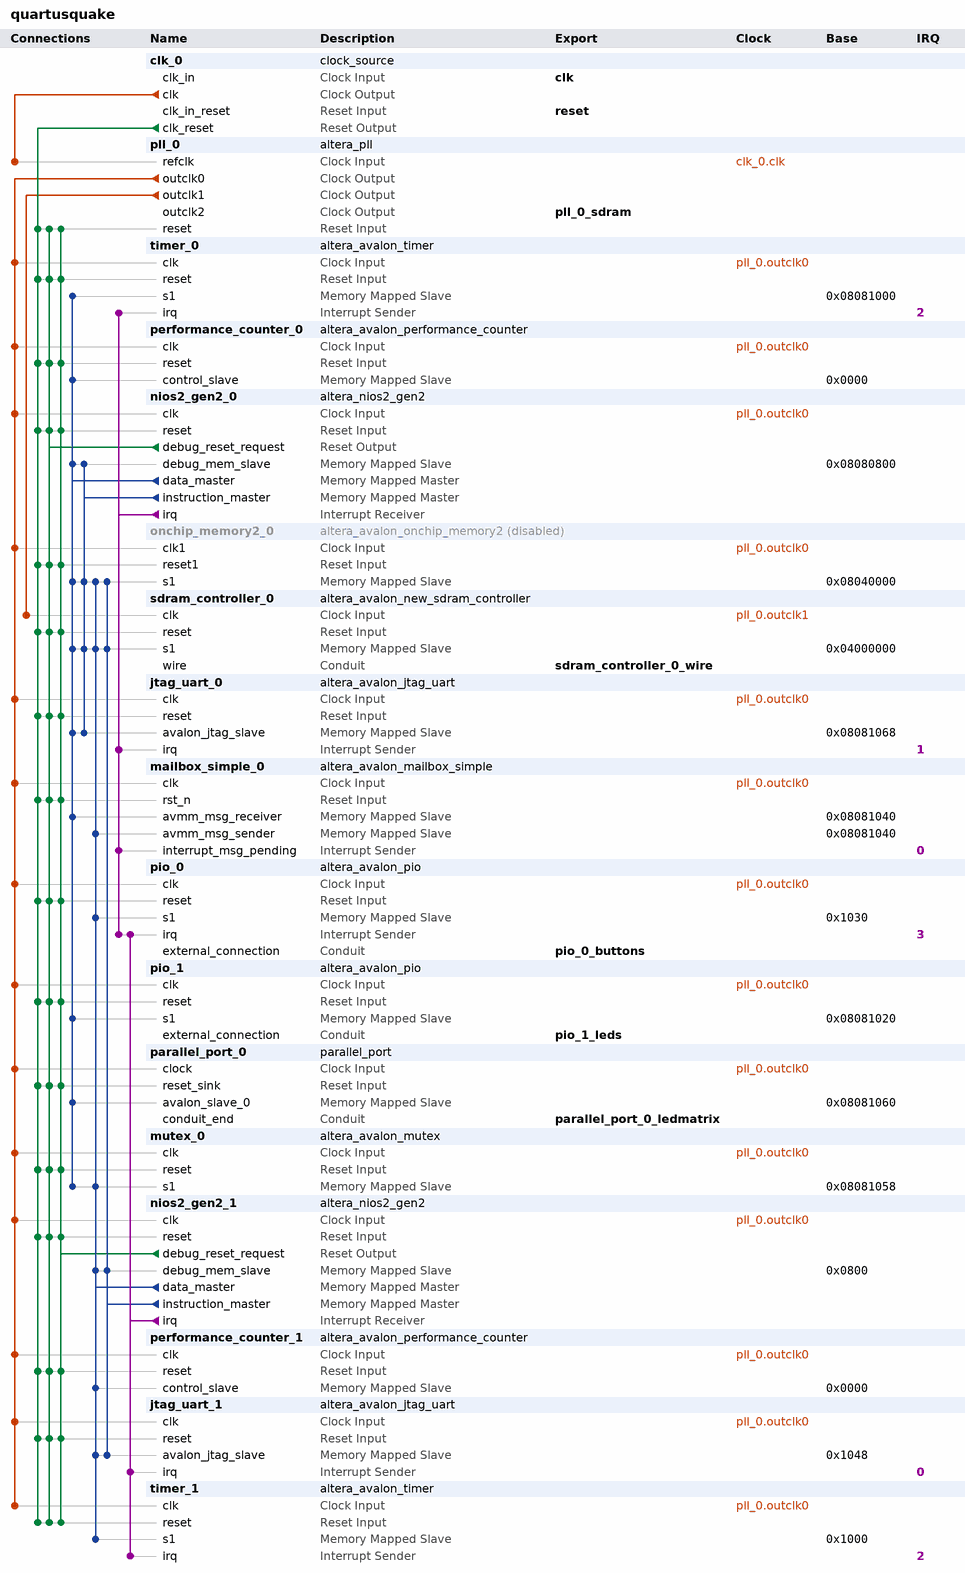
[diagram p0: system contents]
# Platform Designer (Qsys) system quartusquake, Cyclone V 5CSEMA5F31C6
# Parameters at their usual value, and those the tool derives, are not listed.
package require -exact qsys 18.1
create_system quartusquake
set_project_property DEVICE_FAMILY {Cyclone V}
set_project_property DEVICE 5CSEMA5F31C6

add_instance clk_0 clock_source 18.1
set_instance_parameter_value clk_0 clockFrequency 50000000
set_instance_parameter_value clk_0 resetSynchronousEdges DEASSERT

add_instance pll_0 altera_pll 18.1
set_instance_parameter_value pll_0 gui_device_speed_grade 1
set_instance_parameter_value pll_0 gui_number_of_clocks 3
set_instance_parameter_value pll_0 gui_operation_mode normal
set_instance_parameter_value pll_0 gui_output_clock_frequency0 50.0
set_instance_parameter_value pll_0 gui_output_clock_frequency1 100.0
set_instance_parameter_value pll_0 gui_output_clock_frequency2 100.0
set_instance_parameter_value pll_0 gui_phase_shift2 -3758
set_instance_parameter_value pll_0 gui_pll_mode {Integer-N PLL}
set_instance_parameter_value pll_0 gui_reference_clock_frequency 50.0
set_instance_parameter_value pll_0 gui_use_locked false

add_instance timer_0 altera_avalon_timer 18.1
set_instance_parameter_value timer_0 period 50
set_instance_parameter_value timer_0 periodUnits MSEC

add_instance performance_counter_0 altera_avalon_performance_counter 18.1
set_instance_parameter_value performance_counter_0 numberOfSections 3

add_instance nios2_gen2_0 altera_nios2_gen2 18.1
set_instance_parameter_value nios2_gen2_0 dcache_size 0
set_instance_parameter_value nios2_gen2_0 exceptionSlave sdram_controller_0.s1
set_instance_parameter_value nios2_gen2_0 icache_size 0
set_instance_parameter_value nios2_gen2_0 impl Fast
set_instance_parameter_value nios2_gen2_0 resetSlave sdram_controller_0.s1

add_instance onchip_memory2_0 altera_avalon_onchip_memory2 18.1
set_instance_property onchip_memory2_0 ENABLED false
set_instance_parameter_value onchip_memory2_0 dataWidth 32
set_instance_parameter_value onchip_memory2_0 dualPort false
set_instance_parameter_value onchip_memory2_0 initMemContent true
set_instance_parameter_value onchip_memory2_0 initializationFileName onchip_mem.hex
set_instance_parameter_value onchip_memory2_0 memorySize 262144

add_instance sdram_controller_0 altera_avalon_new_sdram_controller 18.1
set_instance_parameter_value sdram_controller_0 TAC 5.4
set_instance_parameter_value sdram_controller_0 TRCD 15.0
set_instance_parameter_value sdram_controller_0 TRP 15.0
set_instance_parameter_value sdram_controller_0 casLatency 3
set_instance_parameter_value sdram_controller_0 columnWidth 10
set_instance_parameter_value sdram_controller_0 dataWidth 16
set_instance_parameter_value sdram_controller_0 generateSimulationModel false
set_instance_parameter_value sdram_controller_0 model single_Micron_MT48LC4M32B2_7_chip
set_instance_parameter_value sdram_controller_0 numberOfBanks 4
set_instance_parameter_value sdram_controller_0 numberOfChipSelects 1
set_instance_parameter_value sdram_controller_0 powerUpDelay 100.0
set_instance_parameter_value sdram_controller_0 refreshPeriod 7.8125
set_instance_parameter_value sdram_controller_0 rowWidth 13

add_instance jtag_uart_0 altera_avalon_jtag_uart 18.1
set_instance_parameter_value jtag_uart_0 simInteractiveOptions NO_INTERACTIVE_WINDOWS

add_instance mailbox_simple_0 altera_avalon_mailbox_simple 18.1
set_instance_parameter_value mailbox_simple_0 AWIDTH 2
set_instance_parameter_value mailbox_simple_0 DWIDTH 32
set_instance_parameter_value mailbox_simple_0 MSG_ARRIVAL_NOTIFY 1
set_instance_parameter_value mailbox_simple_0 MSG_SPACE_NOTIFY 0

add_instance pio_0 altera_avalon_pio 18.1
set_instance_parameter_value pio_0 captureEdge true
set_instance_parameter_value pio_0 direction Input
set_instance_parameter_value pio_0 edgeType FALLING
set_instance_parameter_value pio_0 generateIRQ true
set_instance_parameter_value pio_0 irqType EDGE
set_instance_parameter_value pio_0 width 4

add_instance pio_1 altera_avalon_pio 18.1
set_instance_parameter_value pio_1 bitModifyingOutReg true
set_instance_parameter_value pio_1 direction Output
set_instance_parameter_value pio_1 width 10

add_instance parallel_port_0 parallel_port 1.0

add_instance mutex_0 altera_avalon_mutex 18.1

add_instance nios2_gen2_1 altera_nios2_gen2 18.1
set_instance_parameter_value nios2_gen2_1 dcache_size 0
set_instance_parameter_value nios2_gen2_1 exceptionOffset 1048608
set_instance_parameter_value nios2_gen2_1 exceptionSlave sdram_controller_0.s1
set_instance_parameter_value nios2_gen2_1 icache_size 0
set_instance_parameter_value nios2_gen2_1 impl Fast
set_instance_parameter_value nios2_gen2_1 resetOffset 1048576
set_instance_parameter_value nios2_gen2_1 resetSlave sdram_controller_0.s1

add_instance performance_counter_1 altera_avalon_performance_counter 18.1
set_instance_parameter_value performance_counter_1 numberOfSections 3

add_instance jtag_uart_1 altera_avalon_jtag_uart 18.1
set_instance_parameter_value jtag_uart_1 simInteractiveOptions NO_INTERACTIVE_WINDOWS

add_instance timer_1 altera_avalon_timer 18.1
set_instance_parameter_value timer_1 period 1
set_instance_parameter_value timer_1 periodUnits MSEC

# connections
add_connection clk_0.clk pll_0.refclk clock
add_connection pll_0.outclk0 jtag_uart_0.clk clock
add_connection pll_0.outclk0 jtag_uart_1.clk clock
add_connection pll_0.outclk0 mailbox_simple_0.clk clock
add_connection pll_0.outclk0 mutex_0.clk clock
add_connection pll_0.outclk0 nios2_gen2_0.clk clock
add_connection pll_0.outclk0 nios2_gen2_1.clk clock
add_connection pll_0.outclk0 onchip_memory2_0.clk1 clock
add_connection pll_0.outclk0 parallel_port_0.clock clock
add_connection pll_0.outclk0 performance_counter_0.clk clock
add_connection pll_0.outclk0 performance_counter_1.clk clock
add_connection pll_0.outclk0 pio_0.clk clock
add_connection pll_0.outclk0 pio_1.clk clock
add_connection pll_0.outclk0 timer_0.clk clock
add_connection pll_0.outclk0 timer_1.clk clock
add_connection pll_0.outclk1 sdram_controller_0.clk clock
add_connection clk_0.clk_reset jtag_uart_0.reset reset
add_connection clk_0.clk_reset jtag_uart_1.reset reset
add_connection clk_0.clk_reset mailbox_simple_0.rst_n reset
add_connection clk_0.clk_reset mutex_0.reset reset
add_connection clk_0.clk_reset nios2_gen2_0.reset reset
add_connection clk_0.clk_reset nios2_gen2_1.reset reset
add_connection clk_0.clk_reset onchip_memory2_0.reset1 reset
add_connection clk_0.clk_reset parallel_port_0.reset_sink reset
add_connection clk_0.clk_reset performance_counter_0.reset reset
add_connection clk_0.clk_reset performance_counter_1.reset reset
add_connection clk_0.clk_reset pio_0.reset reset
add_connection clk_0.clk_reset pio_1.reset reset
add_connection clk_0.clk_reset pll_0.reset reset
add_connection clk_0.clk_reset sdram_controller_0.reset reset
add_connection clk_0.clk_reset timer_0.reset reset
add_connection clk_0.clk_reset timer_1.reset reset
add_connection nios2_gen2_0.debug_reset_request jtag_uart_0.reset reset
add_connection nios2_gen2_0.debug_reset_request jtag_uart_1.reset reset
add_connection nios2_gen2_0.debug_reset_request mailbox_simple_0.rst_n reset
add_connection nios2_gen2_0.debug_reset_request mutex_0.reset reset
add_connection nios2_gen2_0.debug_reset_request nios2_gen2_0.reset reset
add_connection nios2_gen2_0.debug_reset_request nios2_gen2_1.reset reset
add_connection nios2_gen2_0.debug_reset_request onchip_memory2_0.reset1 reset
add_connection nios2_gen2_0.debug_reset_request parallel_port_0.reset_sink reset
add_connection nios2_gen2_0.debug_reset_request performance_counter_0.reset reset
add_connection nios2_gen2_0.debug_reset_request performance_counter_1.reset reset
add_connection nios2_gen2_0.debug_reset_request pio_0.reset reset
add_connection nios2_gen2_0.debug_reset_request pio_1.reset reset
add_connection nios2_gen2_0.debug_reset_request pll_0.reset reset
add_connection nios2_gen2_0.debug_reset_request sdram_controller_0.reset reset
add_connection nios2_gen2_0.debug_reset_request timer_0.reset reset
add_connection nios2_gen2_0.debug_reset_request timer_1.reset reset
add_connection nios2_gen2_1.debug_reset_request jtag_uart_0.reset reset
add_connection nios2_gen2_1.debug_reset_request jtag_uart_1.reset reset
add_connection nios2_gen2_1.debug_reset_request mailbox_simple_0.rst_n reset
add_connection nios2_gen2_1.debug_reset_request mutex_0.reset reset
add_connection nios2_gen2_1.debug_reset_request nios2_gen2_0.reset reset
add_connection nios2_gen2_1.debug_reset_request nios2_gen2_1.reset reset
add_connection nios2_gen2_1.debug_reset_request onchip_memory2_0.reset1 reset
add_connection nios2_gen2_1.debug_reset_request parallel_port_0.reset_sink reset
add_connection nios2_gen2_1.debug_reset_request performance_counter_0.reset reset
add_connection nios2_gen2_1.debug_reset_request performance_counter_1.reset reset
add_connection nios2_gen2_1.debug_reset_request pio_0.reset reset
add_connection nios2_gen2_1.debug_reset_request pio_1.reset reset
add_connection nios2_gen2_1.debug_reset_request pll_0.reset reset
add_connection nios2_gen2_1.debug_reset_request sdram_controller_0.reset reset
add_connection nios2_gen2_1.debug_reset_request timer_0.reset reset
add_connection nios2_gen2_1.debug_reset_request timer_1.reset reset
add_connection nios2_gen2_0.data_master jtag_uart_0.avalon_jtag_slave avalon
set_connection_parameter_value nios2_gen2_0.data_master/jtag_uart_0.avalon_jtag_slave baseAddress 0x08081068
add_connection nios2_gen2_0.data_master mailbox_simple_0.avmm_msg_receiver avalon
set_connection_parameter_value nios2_gen2_0.data_master/mailbox_simple_0.avmm_msg_receiver baseAddress 0x08081040
add_connection nios2_gen2_0.data_master mutex_0.s1 avalon
set_connection_parameter_value nios2_gen2_0.data_master/mutex_0.s1 baseAddress 0x08081058
add_connection nios2_gen2_0.data_master nios2_gen2_0.debug_mem_slave avalon
set_connection_parameter_value nios2_gen2_0.data_master/nios2_gen2_0.debug_mem_slave baseAddress 0x08080800
add_connection nios2_gen2_0.data_master onchip_memory2_0.s1 avalon
set_connection_parameter_value nios2_gen2_0.data_master/onchip_memory2_0.s1 baseAddress 0x08040000
add_connection nios2_gen2_0.data_master parallel_port_0.avalon_slave_0 avalon
set_connection_parameter_value nios2_gen2_0.data_master/parallel_port_0.avalon_slave_0 baseAddress 0x08081060
add_connection nios2_gen2_0.data_master performance_counter_0.control_slave avalon
set_connection_parameter_value nios2_gen2_0.data_master/performance_counter_0.control_slave baseAddress 0x0000
add_connection nios2_gen2_0.data_master pio_1.s1 avalon
set_connection_parameter_value nios2_gen2_0.data_master/pio_1.s1 baseAddress 0x08081020
add_connection nios2_gen2_0.data_master sdram_controller_0.s1 avalon
set_connection_parameter_value nios2_gen2_0.data_master/sdram_controller_0.s1 baseAddress 0x04000000
add_connection nios2_gen2_0.data_master timer_0.s1 avalon
set_connection_parameter_value nios2_gen2_0.data_master/timer_0.s1 baseAddress 0x08081000
add_connection nios2_gen2_0.instruction_master jtag_uart_0.avalon_jtag_slave avalon
set_connection_parameter_value nios2_gen2_0.instruction_master/jtag_uart_0.avalon_jtag_slave baseAddress 0x08081068
add_connection nios2_gen2_0.instruction_master nios2_gen2_0.debug_mem_slave avalon
set_connection_parameter_value nios2_gen2_0.instruction_master/nios2_gen2_0.debug_mem_slave baseAddress 0x08080800
add_connection nios2_gen2_0.instruction_master onchip_memory2_0.s1 avalon
set_connection_parameter_value nios2_gen2_0.instruction_master/onchip_memory2_0.s1 baseAddress 0x08040000
add_connection nios2_gen2_0.instruction_master sdram_controller_0.s1 avalon
set_connection_parameter_value nios2_gen2_0.instruction_master/sdram_controller_0.s1 baseAddress 0x04000000
add_connection nios2_gen2_1.data_master jtag_uart_1.avalon_jtag_slave avalon
set_connection_parameter_value nios2_gen2_1.data_master/jtag_uart_1.avalon_jtag_slave baseAddress 0x1048
add_connection nios2_gen2_1.data_master mailbox_simple_0.avmm_msg_sender avalon
set_connection_parameter_value nios2_gen2_1.data_master/mailbox_simple_0.avmm_msg_sender baseAddress 0x08081040
add_connection nios2_gen2_1.data_master mutex_0.s1 avalon
set_connection_parameter_value nios2_gen2_1.data_master/mutex_0.s1 baseAddress 0x08081058
add_connection nios2_gen2_1.data_master nios2_gen2_1.debug_mem_slave avalon
set_connection_parameter_value nios2_gen2_1.data_master/nios2_gen2_1.debug_mem_slave baseAddress 0x0800
add_connection nios2_gen2_1.data_master onchip_memory2_0.s1 avalon
set_connection_parameter_value nios2_gen2_1.data_master/onchip_memory2_0.s1 baseAddress 0x08040000
add_connection nios2_gen2_1.data_master performance_counter_1.control_slave avalon
set_connection_parameter_value nios2_gen2_1.data_master/performance_counter_1.control_slave baseAddress 0x0000
add_connection nios2_gen2_1.data_master pio_0.s1 avalon
set_connection_parameter_value nios2_gen2_1.data_master/pio_0.s1 baseAddress 0x1030
add_connection nios2_gen2_1.data_master sdram_controller_0.s1 avalon
set_connection_parameter_value nios2_gen2_1.data_master/sdram_controller_0.s1 baseAddress 0x04000000
add_connection nios2_gen2_1.data_master timer_1.s1 avalon
set_connection_parameter_value nios2_gen2_1.data_master/timer_1.s1 baseAddress 0x1000
add_connection nios2_gen2_1.instruction_master jtag_uart_1.avalon_jtag_slave avalon
set_connection_parameter_value nios2_gen2_1.instruction_master/jtag_uart_1.avalon_jtag_slave baseAddress 0x1048
add_connection nios2_gen2_1.instruction_master nios2_gen2_1.debug_mem_slave avalon
set_connection_parameter_value nios2_gen2_1.instruction_master/nios2_gen2_1.debug_mem_slave baseAddress 0x0800
add_connection nios2_gen2_1.instruction_master onchip_memory2_0.s1 avalon
set_connection_parameter_value nios2_gen2_1.instruction_master/onchip_memory2_0.s1 baseAddress 0x08040000
add_connection nios2_gen2_1.instruction_master sdram_controller_0.s1 avalon
set_connection_parameter_value nios2_gen2_1.instruction_master/sdram_controller_0.s1 baseAddress 0x04000000
add_connection nios2_gen2_0.irq jtag_uart_0.irq interrupt
set_connection_parameter_value nios2_gen2_0.irq/jtag_uart_0.irq irqNumber 1
add_connection nios2_gen2_0.irq mailbox_simple_0.interrupt_msg_pending interrupt
set_connection_parameter_value nios2_gen2_0.irq/mailbox_simple_0.interrupt_msg_pending irqNumber 0
add_connection nios2_gen2_0.irq pio_0.irq interrupt
set_connection_parameter_value nios2_gen2_0.irq/pio_0.irq irqNumber 3
add_connection nios2_gen2_0.irq timer_0.irq interrupt
set_connection_parameter_value nios2_gen2_0.irq/timer_0.irq irqNumber 2
add_connection nios2_gen2_1.irq jtag_uart_1.irq interrupt
set_connection_parameter_value nios2_gen2_1.irq/jtag_uart_1.irq irqNumber 0
add_connection nios2_gen2_1.irq pio_0.irq interrupt
set_connection_parameter_value nios2_gen2_1.irq/pio_0.irq irqNumber 1
add_connection nios2_gen2_1.irq timer_1.irq interrupt
set_connection_parameter_value nios2_gen2_1.irq/timer_1.irq irqNumber 2

# exported interfaces
add_interface clk clock sink
set_interface_property clk EXPORT_OF clk_0.clk_in
add_interface parallel_port_0_ledmatrix conduit end
set_interface_property parallel_port_0_ledmatrix EXPORT_OF parallel_port_0.conduit_end
add_interface pio_0_buttons conduit end
set_interface_property pio_0_buttons EXPORT_OF pio_0.external_connection
add_interface pio_1_leds conduit end
set_interface_property pio_1_leds EXPORT_OF pio_1.external_connection
add_interface pll_0_sdram clock source
set_interface_property pll_0_sdram EXPORT_OF pll_0.outclk2
add_interface reset reset sink
set_interface_property reset EXPORT_OF clk_0.clk_in_reset
add_interface sdram_controller_0_wire conduit end
set_interface_property sdram_controller_0_wire EXPORT_OF sdram_controller_0.wire

set_interconnect_requirement {$system} qsys_mm.clockCrossingAdapter HANDSHAKE
set_interconnect_requirement {$system} qsys_mm.enableEccProtection FALSE
set_interconnect_requirement {$system} qsys_mm.insertDefaultSlave FALSE
set_interconnect_requirement {$system} qsys_mm.maxAdditionalLatency 1

save_system quartusquake.qsys
